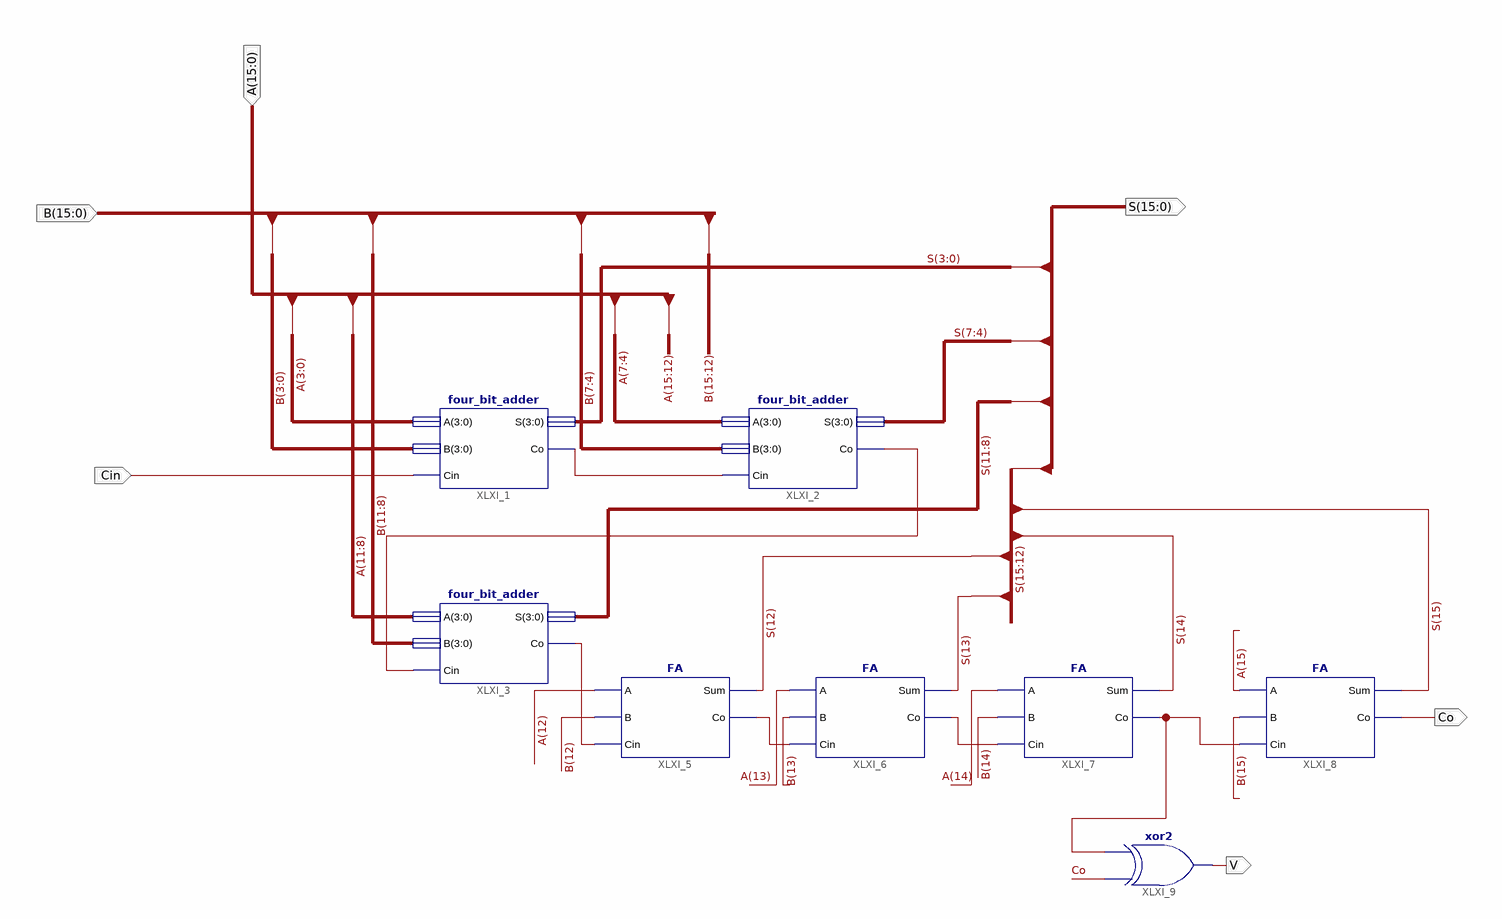
[diagram p0: schematic sheet 1]
// Xilinx ISE schematic sixteen_bit_adder.sch (artix7) as structural Verilog: 8 symbols, 6 ports
module sixteen_bit_adder (
  input  [15:0] A,
  input  [15:0] B,
  input  Cin,
  output [15:0] S,
  output Co,
  output V
);

  wire XLXN_1, XLXN_2, XLXN_4, XLXN_7, XLXN_8, XLXN_39;

  four_bit_adder XLXI_1 (.A(A[3:0]), .B(B[3:0]), .Cin(Cin), .Co(XLXN_1), .S(S[3:0]));
  four_bit_adder XLXI_2 (.A(A[7:4]), .B(B[7:4]), .Cin(XLXN_1), .Co(XLXN_2), .S(S[7:4]));
  four_bit_adder XLXI_3 (.A(A[11:8]), .B(B[11:8]), .Cin(XLXN_2), .Co(XLXN_4), .S(S[11:8]));
  FA XLXI_5 (.A(A[12]), .B(B[12]), .Cin(XLXN_4), .Co(XLXN_7), .Sum(S[12]));
  FA XLXI_6 (.A(A[13]), .B(B[13]), .Cin(XLXN_7), .Co(XLXN_8), .Sum(S[13]));
  FA XLXI_7 (.A(A[14]), .B(B[14]), .Cin(XLXN_8), .Co(XLXN_39), .Sum(S[14]));
  FA XLXI_8 (.A(A[15]), .B(B[15]), .Cin(XLXN_39), .Co(Co), .Sum(S[15]));
  xor XLXI_9 (V, Co, XLXN_39);
endmodule
